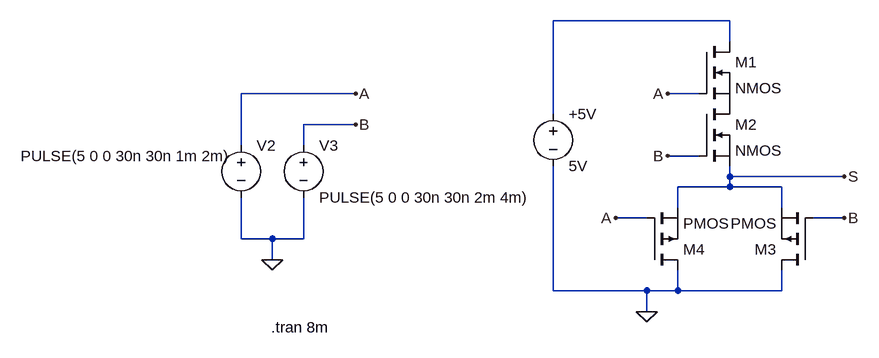
[diagram p0: schematic Porte AND.asc]
Porte AND.asc, the LTspice schematic file:
Version 4
SHEET 1 880 680
WIRE 352 48 80 48
WIRE 352 80 352 48
WIRE -224 160 -400 160
WIRE 304 160 256 160
WIRE 80 192 80 48
WIRE -224 208 -304 208
WIRE -400 240 -400 160
WIRE -304 240 -304 208
WIRE 304 256 256 256
WIRE 352 288 352 272
WIRE 528 288 352 288
WIRE 352 304 352 288
WIRE 352 304 272 304
WIRE 432 304 352 304
WIRE 272 336 272 304
WIRE 432 336 432 304
WIRE 224 352 176 352
WIRE 528 352 480 352
WIRE -400 384 -400 320
WIRE -352 384 -400 384
WIRE -304 384 -304 320
WIRE -304 384 -352 384
WIRE -352 416 -352 384
WIRE 80 464 80 272
WIRE 224 464 80 464
WIRE 272 464 272 432
WIRE 272 464 224 464
WIRE 432 464 432 432
WIRE 432 464 272 464
WIRE 224 496 224 464
FLAG -352 416 0
FLAG -224 160 A
FLAG -224 208 B
FLAG 256 160 A
FLAG 256 256 B
FLAG 224 496 0
FLAG 176 352 A
FLAG 528 352 B
FLAG 528 288 S
SYMBOL voltage 80 176 R0
WINDOW 123 0 0 Left 0
WINDOW 39 0 0 Left 0
SYMATTR InstName +5V
SYMATTR Value 5V
SYMBOL voltage -400 224 R0
WINDOW 3 -339 32 Left 2
WINDOW 123 0 0 Left 0
WINDOW 39 0 0 Left 0
SYMATTR InstName V2
SYMATTR Value PULSE(5 0 0 30n 30n 1m 2m)
SYMBOL voltage -304 224 R0
WINDOW 123 0 0 Left 0
WINDOW 39 0 0 Left 0
SYMATTR InstName V3
SYMATTR Value PULSE(5 0 0 30n 30n 2m 4m)
SYMBOL nmos 304 80 R0
SYMATTR InstName M1
SYMBOL nmos 304 176 R0
SYMATTR InstName M2
SYMBOL pmos 224 432 M180
SYMATTR InstName M4
SYMBOL pmos 480 432 R180
SYMATTR InstName M3
TEXT -354 520 Left 2 !.tran 8m

The netlist it stands for:
* Porte AND.asc
V§+5V N001 0 5V
V2 A 0 PULSE(5 0 0 30n 30n 1m 2m)
V3 B 0 PULSE(5 0 0 30n 30n 2m 4m)
M1 N001 A P001 P001 NMOS
M2 P001 B S S NMOS
M4 0 A S S PMOS
M3 0 B S S PMOS
.model NMOS NMOS
.model PMOS PMOS
.lib standard.mos
.tran 8m
.backanno
.end

* Results of the author's LTspice run, read from the files saved beside the schematic
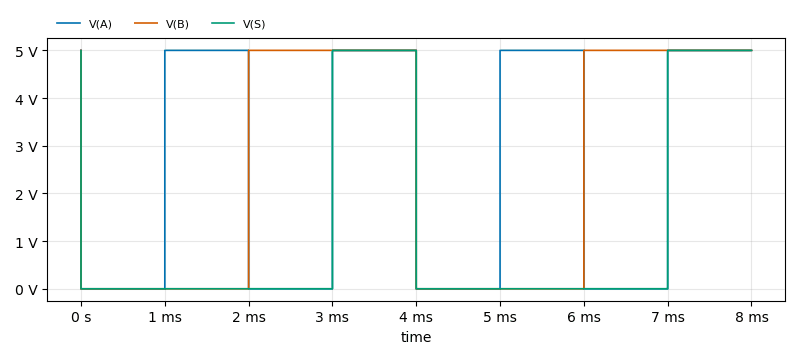
[diagram p1: Transient Analysis of Porte AND.asc, plotted from the saved traces]
* Transient Analysis, 1 run:
*   V(A): min 0 V, max 5 V, average 2.5 V, rms 3.535 V, last 5 V
*   V(B): min 0 V, max 5 V, average 2.5 V, rms 3.536 V, last 5 V
*   V(S): min 500.4 µV, max 4.998 V, average 1.25 V, rms 2.499 V, last 4.998 V